# EAGLE schematic laser_sync (EAGLE 5.09)
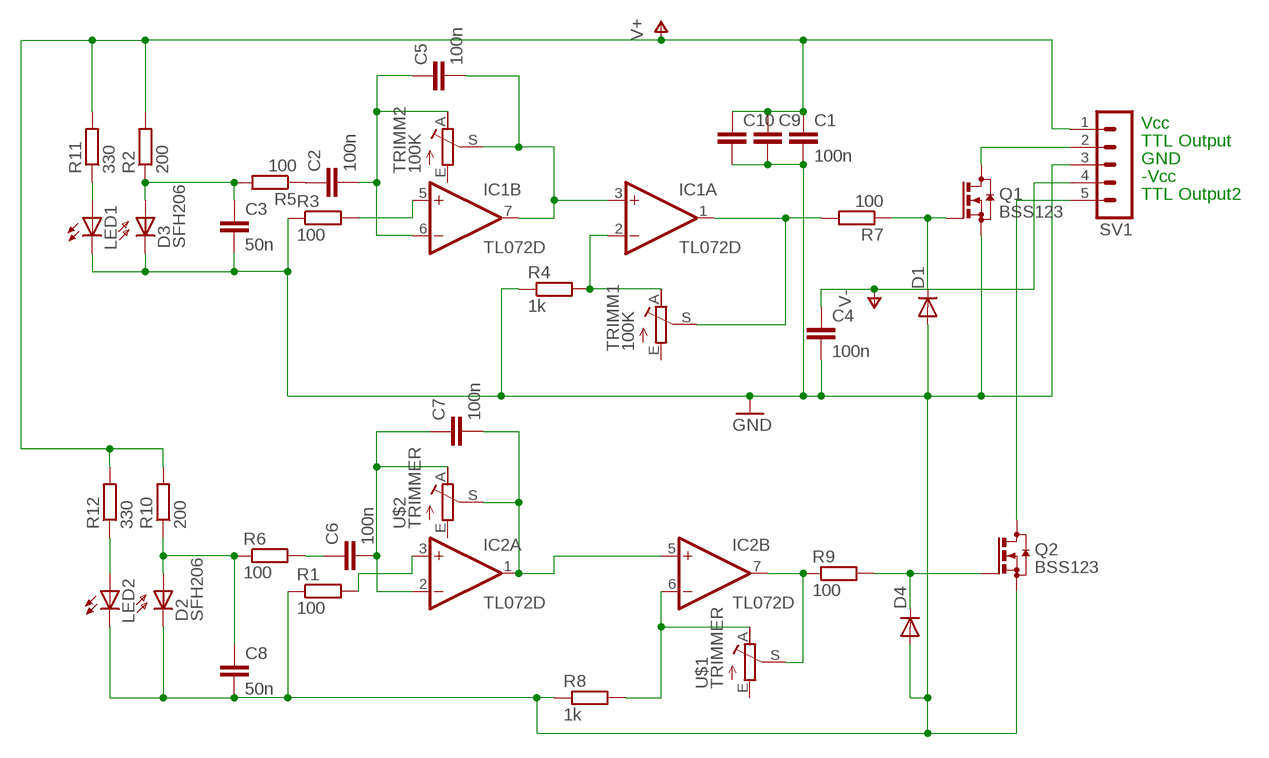
[diagram p0: schematic, sheet 1]

## Parts
C1  100n  C-EUC0805  [C0805]
C2  100n  C-EUC0805  [C0805]
C3  50n  C-EUC0805  [C0805]
C4  100n  C-EUC0805  [C0805]
C5  100n  C-EUC0805  [C0805]
C6  100n  C-EUC0805  [C0805]
C7  100n  C-EUC0805  [C0805]
C8  50n  C-EUC0805  [C0805]
C9  C-EUC1210  [C1210]
C10  C-EUC1210  [C1210]
D1  DIODE-SOD123  [SOD123]
D2  SFH206  [SFH206]
D3  SFH206  [SFH206]
D4  DIODE-SOD123  [SOD123]
IC1  TL072D  [SO08]
IC2  TL072D  [SO08]
LED1  LED5MM  [LED5MM]
LED2  LED5MM  [LED5MM]
Q1  BSS123  [SOT23]
Q2  BSS123  [SOT23]
R1  100  R-EU_M0805  [M0805]
R2  200  R-EU_0207/7  [0207/7]
R3  100  R-EU_M0805  [M0805]
R4  1k  R-EU_R0805  [R0805]
R5  100  R-EU_M0805  [M0805]
R6  100  R-EU_M0805  [M0805]
R7  100  R-EU_R0805  [R0805]
R8  1k  R-EU_M0805  [M0805]
R9  100  R-EU_M0805  [M0805]
R10  200  R-EU_0207/7  [0207/7]
R11  330  R-EU_0207/7  [0207/7]
R12  330  R-EU_0207/7  [0207/7]
SV1  MA05-1  [MA05-1]
TRIMM1  100K  TRIMMER  [TRIMMER_SMD]
TRIMM2  100K  TRIMMER  [TRIMMER_SMD]
U$1  TRIMMER  [TRIMMER_SMD]
U$2  TRIMMER  [TRIMMER_SMD]

## Nets
GND: C1.2 C3.2 C4.2 C8.2 C9.2 C10.2 D1.A D2.K(C) D3.K(C) D4.A LED1.K(C) LED2.K(C) Q1.2(S) Q2.2(S) R1.1 R3.1 R4.1 R8.1 SV1.3
N$1: IC1.2(A:-IN) R4.2 TRIMM1.A
N$2: C3.1 D3.A R2.1 R5.2
N$3: D1.C Q1.1(G) R7.1
N$4: IC1.1(A:OUT) R7.2 TRIMM1.S
N$5: C2.2 C5.1 IC1.6(B:-IN) TRIMM2.A
N$6: C7.2 IC2.1(A:OUT) IC2.5(B:+IN) U$2.S
N$7: IC1.5(B:+IN) R3.2
N$8: C8.1 D2.A R6.1 R10.1
N$9: IC2.6(B:-IN) R8.2 U$1.A
N$10: Q2.3(D) SV1.5
N$11: C2.1 R5.1
N$12: C6.1 R6.2
N$13: C6.2 C7.1 IC2.2(A:-IN) U$2.A
N$14: IC2.3(A:+IN) R1.2
N$15: C5.2 IC1.3(A:+IN) IC1.7(B:OUT) TRIMM2.S
N$17: IC2.7(B:OUT) R9.1 U$1.S
N$18: D4.C Q2.1(G) R9.2
N$24: LED2.A R12.1
N$25: Q1.3(D) SV1.2
N$26: LED1.A R11.1
V+: C1.1 C9.1 C10.1 R2.2 R10.2 R11.2 R12.2 SV1.1
V-: C4.1 SV1.4
Unconnected: TRIMM1.E TRIMM2.E U$1.E U$2.E

## Notes on the sheet
- Vcc
- TTL Output
- GND
- -Vcc
- TTL Output2

## Power pins joined to a net without a drawn wire
V+: IC1.8(P:V+) IC2.8(P:V+)
V-: IC1.4(P:V-) IC2.4(P:V-)

## Library data of the parts
C1-C10 = rcl:C-EU: CAPACITOR, European symbol
D1 D4 = diode:DIODE-: DIODE
D2 D3 = opto-trans-siemens:SFH206: PHOTO DIODE
IC1 IC2 = linear:TL072: OP AMP
LED1 LED2 = led:LED: LED OSRAM: - CHIPLED LG R971, LG N971, LY N971, LG Q971, LY Q971, LO R971, LY R971 LH N974, LH R974 LS Q976, LO Q976, LY Q976 LO Q996 - Hyper CHIPLED LW Q18S LB Q993, LB Q99A, LB R99A - SideLED LS A670, LO A670, LY A670, LG A670, LP A670 LB A673, LV A673, LT A673, LW A673 LH A674 LY A675 LS A676, LA A676, LO A676, LY A676, LW A676 LS A679, LY A679, LG A679 - Hyper Micro SIDELED® LS Y876, LA Y876, LO Y876, LY Y876 LT Y87S - SmartLED LW L88C, LW L88S LB L89C, LB L89S, LG L890 LS L89K, LO L89K, LY L89K LS L896, LA L896, LO L896, LY L896 - TOPLED LS T670, LO T670, LY T670, LG T670, LP T670 LSG T670, LSP T670, LSY T670, LOP T670, LYG T670 LG T671, LOG T671, LSG T671 LB T673, LV T673, LT T673, LW T673 LH T674 LS T676, LA T676, LO T676, LY T676, LB T676, LH T676, LSB T676, LW T676 LB T67C, LV T67C, LT T67C, LS T67K, LO T67K, LY T67K, LW E67C LS E67B, LA E67B, LO E67B, LY E67B, LB E67C, LV E67C, LT E67C LW T67C LS T679, LY T679, LG T679 LS T770, LO T770, LY T770, LG T770, LP T770 LB T773, LV T773, LT T773, LW T773 LH T774 LS E675, LA E675, LY E675, LS T675 LS T776, LA T776, LO T776, LY T776, LB T776 LHGB T686 LT T68C, LB T68C - Hyper Mini TOPLED® LB M676 - Mini TOPLED Santana® LG M470 LS M47K, LO M47K, LY M47K Source: http://www.osram.convergy.de LUXEON: - LUMILED® LXK2-PW12-R00, LXK2-PW12-S00, LXK2-PW14-U00, LXK2-PW14-V00 LXK2-PM12-R00, LXK2-PM12-S00, LXK2-PM14-U00 LXK2-PE12-Q00, LXK2-PE12-R00, LXK2-PE12-S00, LXK2-PE14-T00, LXK2-PE14-U00 LXK2-PB12-K00, LXK2-PB12-L00, LXK2-PB12-M00, LXK2-PB14-N00, LXK2-PB14-P00, LXK2-PB14-Q00 LXK2-PR12-L00, LXK2-PR12-M00, LXK2-PR14-Q00, LXK2-PR14-R00 LXK2-PD12-Q00, LXK2-PD12-R00, LXK2-PD12-S00 LXK2-PH12-R00, LXK2-PH12-S00 LXK2-PL12-P00, LXK2-PL12-Q00, LXK2-PL12-R00 Source: www.luxeon.com KINGBRIGHT: KA-3528ASYC Source: www.kingbright.com
Q1 Q2 = transistor-small-signal:BSS123: N-CHANNEL MOS FET
R1 R3 R5-R12 = resistor:R-EU_: RESISTOR, European symbol
R2 R4 = rcl:R-EU_: RESISTOR, European symbol
SV1 = con-lstb:MA05-1: PIN HEADER
TRIMM1 TRIMM2 U$1 U$2 = siro:TRIMMER